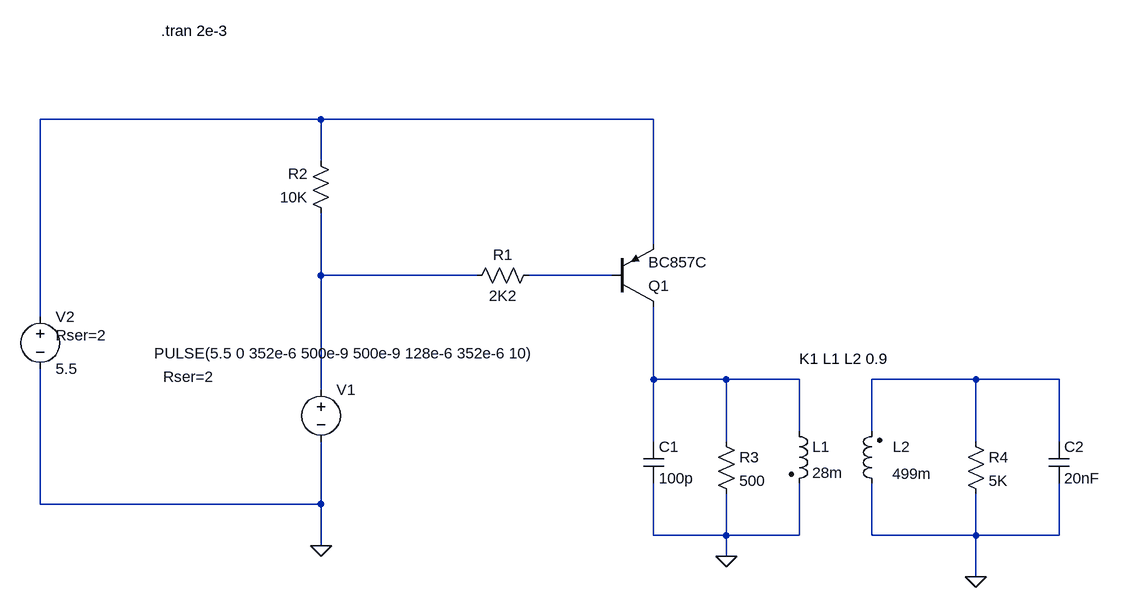
[diagram p0: schematic Buzz_drive_traffo.asc]
Buzz_drive_traffo.asc, the LTspice schematic file:
Version 4
SHEET 1 880 680
WIRE -528 -448 -960 -448
WIRE -16 -448 -528 -448
WIRE -528 -384 -528 -448
WIRE -16 -256 -16 -448
WIRE -528 -208 -528 -304
WIRE -288 -208 -528 -208
WIRE -80 -208 -208 -208
WIRE -960 -144 -960 -448
WIRE -16 -48 -16 -160
WIRE 96 -48 -16 -48
WIRE 208 -48 96 -48
WIRE 480 -48 320 -48
WIRE 608 -48 480 -48
WIRE -528 -32 -528 -208
WIRE 208 32 208 -48
WIRE 320 32 320 -48
WIRE -16 48 -16 -48
WIRE 96 48 96 -48
WIRE 480 48 480 -48
WIRE 608 48 608 -48
WIRE -960 144 -960 -64
WIRE -528 144 -528 48
WIRE -528 144 -960 144
WIRE -16 192 -16 112
WIRE 96 192 96 128
WIRE 96 192 -16 192
WIRE 208 192 208 112
WIRE 208 192 96 192
WIRE 320 192 320 112
WIRE 480 192 480 128
WIRE 480 192 320 192
WIRE 608 192 608 112
WIRE 608 192 480 192
WIRE -528 208 -528 144
WIRE 96 224 96 192
WIRE 480 256 480 192
FLAG 96 224 0
FLAG -528 208 0
FLAG 480 256 0
SYMBOL ind2 192 16 R0
SYMATTR InstName L1
SYMATTR Value 28m
SYMATTR Type ind
SYMATTR SpiceLine Rser=2
SYMBOL cap -32 48 R0
SYMATTR InstName C1
SYMATTR Value 100p
SYMBOL voltage -528 -48 R0
WINDOW 3 -257 -40 Left 2
WINDOW 123 0 0 Left 0
WINDOW 39 -243 -4 Left 2
SYMATTR InstName V1
SYMATTR Value PULSE(5.5 0 352e-6 500e-9 500e-9 128e-6 352e-6 10)
SYMATTR SpiceLine Rser=2
SYMBOL pnp -80 -160 M180
SYMATTR InstName Q1
SYMATTR Value BC857C
SYMBOL res -192 -224 R90
WINDOW 0 0 56 VBottom 2
WINDOW 3 32 56 VTop 2
SYMATTR InstName R1
SYMATTR Value 2K2
SYMBOL res -512 -288 R180
WINDOW 0 36 76 Left 2
WINDOW 3 36 40 Left 2
SYMATTR InstName R2
SYMATTR Value 10K
SYMBOL voltage -960 -160 R0
WINDOW 123 0 0 Left 0
WINDOW 39 24 44 Left 2
SYMATTR InstName V2
SYMATTR Value 5.5
SYMATTR SpiceLine Rser=2
SYMBOL res 80 32 R0
SYMATTR InstName R3
SYMATTR Value 500
SYMBOL ind2 336 128 R180
WINDOW 0 -43 72 Left 2
WINDOW 3 -76 31 Left 2
SYMATTR InstName L2
SYMATTR Value 499m
SYMATTR Type ind
SYMATTR SpiceLine Rser=40
SYMBOL res 464 32 R0
SYMATTR InstName R4
SYMATTR Value 5K
SYMBOL cap 592 48 R0
SYMATTR InstName C2
SYMATTR Value 20nF
TEXT -774 -584 Left 2 !.tran 2e-3
TEXT 208 -80 Left 2 !K1 L1 L2 0.9

The netlist it stands for:
* Buzz_drive_traffo.asc
L1 N004 0 28m Rser=2
C1 N004 0 100p
V1 N002 0 PULSE(5.5 0 352e-6 500e-9 500e-9 128e-6 352e-6 10) Rser=2
Q1 N004 N003 N001 0 BC857C
R1 N003 N002 2K2
R2 N002 N001 10K
V2 N001 0 5.5 Rser=2
R3 N004 0 500
L2 0 N005 499m Rser=40
R4 N005 0 5K
C2 N005 0 20nF
.model NPN NPN
.model PNP PNP
.lib standard.bjt
.tran 2e-3
K1 L1 L2 0.9
.backanno
.end